# Altium schematic sheet mc_ma.SchDoc
size A4
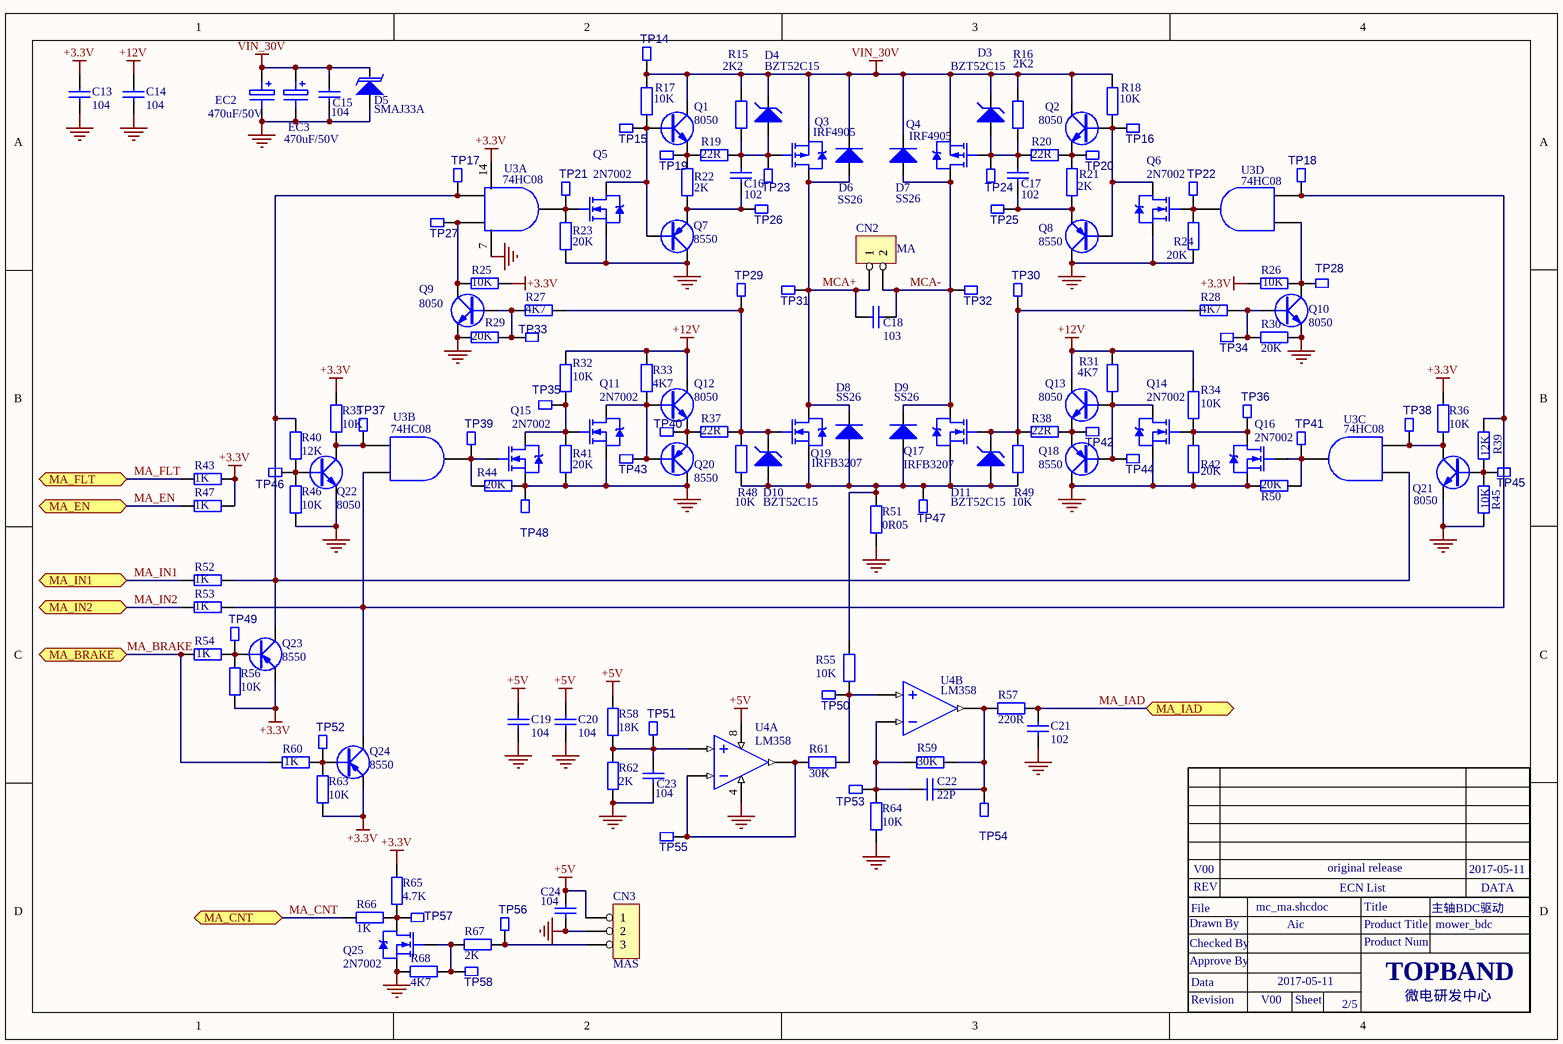
[diagram p0: mc_ma.SchDoc]

## Parts
C13  104  [0603C]
C14  104  [0603C]
C15  104  [0805C]
C16  102  [0805C]
C17  102  [0805C]
C18  103  [1206C]
C19  104  [0603C]
C20  104  [0603C]
C21  102  [0603C]
C22  22P  [0603C]
C23  104  [0603C]
C24  104  [0603C]
CN2  MA  [CON2-3.96]
CN3  MAS  [CON3-2.54]
D3  BZT52C15  [SOD-123]
D4  BZT52C15  [SOD-123]
D5  SMAJ33A  [DO-214AC]
D6  SS26  [SMB]
D7  SS26  [SMB]
D8  SS26  [SMB]
D9  SS26  [SMB]
D10  BZT52C15  [SOD-123]
D11  BZT52C15  [SOD-123]
EC2  470uF/50V  [EC12.5]
EC3  470uF/50V  [EC12.5]
Q1  8050  [SOT-23-BCE]
Q2  8050  [SOT-23-BCE]
Q3  IRF4905  [TO-220-GDS]
Q4  IRF4905  [TO-220-GDS]
Q5  2N7002  [SOT-23-GDS]
Q6  2N7002  [SOT-23-GDS]
Q7  8550  [SOT-23-BCE]
Q8  8550  [SOT-23-BCE]
Q9  8050  [SOT-23-BCE]
Q10  8050  [SOT-23-BCE]
Q11  2N7002  [SOT-23-GDS]
Q12  8050  [SOT-23-BCE]
Q13  8050  [SOT-23-BCE]
Q14  2N7002  [SOT-23-GDS]
Q15  2N7002  [SOT-23-GDS]
Q16  2N7002  [SOT-23-GDS]
Q17  IRFB3207  [TO-220-GDS]
Q18  8550  [SOT-23-BCE]
Q19  IRFB3207  [TO-220-GDS]
Q20  8550  [SOT-23-BCE]
Q21  8050  [SOT-23-BCE]
Q22  8050  [SOT-23-BCE]
Q23  8550  [SOT-23-BCE]
Q24  8550  [SOT-23-BCE]
Q25  2N7002  [SOT-23-GDS]
R15  2K2  [0805R]
R16  2K2  [0805R]
R17  10K  [0603R]
R18  10K  [0603R]
R19  22R  [0805R]
R20  22R  [0805R]
R21  2K  [0805R]
R22  2K  [0805R]
R23  20K  [0603R]
R24  20K  [0603R]
R25  10K  [0603R]
R26  10K  [0603R]
R27  4K7  [0603R]
R28  4K7  [0603R]
R29  20K  [0603R]
R30  20K  [0603R]
R31  4K7  [0603R]
R32  10K  [0603R]
R33  4K7  [0603R]
R34  10K  [0603R]
R35  10K  [0603R]
R36  10K  [0603R]
R37  22R  [0805R]
R38  22R  [0805R]
R39  12K  [0603R]
R40  12K  [0603R]
R41  20K  [0603R]
R42  20K  [0603R]
R43  1K  [0603R]
R44  20K  [0603R]
R45  10K  [0603R]
R46  10K  [0603R]
R47  1K  [0603R]
R48  10K  [0603R]
R49  10K  [0603R]
R50  20K  [0603R]
R51  0R05  [2512R]
R52  1K  [0603R]
R53  1K  [0603R]
R54  1K  [0603R]
R55  10K  [0603R]
R56  10K  [0603R]
R57  220R  [0603R]
R58  18K  [0603R]
R59  30K  [0603R]
R60  1K  [0603R]
R61  30K  [0603R]
R62  2K  [0603R]
R63  10K  [0603R]
R64  10K  [0603R]
R65  4.7K  [0603R]
R66  1K  [0603R]
R67  2K  [0603R]
R68  4K7  [0603R]
TP14  TP  [TEST-0.8MM]  (value not drawn)
TP15  TP  [TEST-0.8MM]  (value not drawn)
TP16  TP  [TEST-0.8MM]  (value not drawn)
TP17  TP  [TEST-0.8MM]  (value not drawn)
TP18  TP  [TEST-0.8MM]  (value not drawn)
TP19  TP  [TEST-0.8MM]  (value not drawn)
TP20  TP  [TEST-0.8MM]  (value not drawn)
TP21  TP  [TEST-0.8MM]  (value not drawn)
TP22  TP  [TEST-0.8MM]  (value not drawn)
TP23  TP  [TEST-0.8MM]  (value not drawn)
TP24  TP  [TEST-0.8MM]  (value not drawn)
TP25  TP  [TEST-0.8MM]  (value not drawn)
TP26  TP  [TEST-0.8MM]  (value not drawn)
TP27  TP  [TEST-0.8MM]  (value not drawn)
TP28  TP  [TEST-0.8MM]  (value not drawn)
TP29  TP  [TEST-0.8MM]  (value not drawn)
TP30  TP  [TEST-0.8MM]  (value not drawn)
TP31  TP  [TEST-0.8MM]  (value not drawn)
TP32  TP  [TEST-0.8MM]  (value not drawn)
TP33  TP  [TEST-0.8MM]  (value not drawn)
TP34  TP  [TEST-0.8MM]  (value not drawn)
TP35  TP  [TEST-0.8MM]  (value not drawn)
TP36  TP  [TEST-0.8MM]  (value not drawn)
TP37  TP  [TEST-0.8MM]  (value not drawn)
TP38  TP  [TEST-0.8MM]  (value not drawn)
TP39  TP  [TEST-0.8MM]  (value not drawn)
TP40  TP  [TEST-0.8MM]  (value not drawn)
TP41  TP  [TEST-0.8MM]  (value not drawn)
TP42  TP  [TEST-0.8MM]  (value not drawn)
TP43  TP  [TEST-0.8MM]  (value not drawn)
TP44  TP  [TEST-0.8MM]  (value not drawn)
TP45  TP  [TEST-0.8MM]  (value not drawn)
TP46  TP  [TEST-0.8MM]  (value not drawn)
TP47  TP  [TEST-0.8MM]  (value not drawn)
TP48  TP  [TEST-0.8MM]  (value not drawn)
TP49  TP  [TEST-0.8MM]  (value not drawn)
TP50  TP  [TEST-0.8MM]  (value not drawn)
TP51  TP  [TEST-0.8MM]  (value not drawn)
TP52  TP  [TEST-0.8MM]  (value not drawn)
TP53  TP  [TEST-0.8MM]  (value not drawn)
TP54  TP  [TEST-0.8MM]  (value not drawn)
TP55  TP  [TEST-0.8MM]  (value not drawn)
TP56  TP  [TEST-0.8MM]  (value not drawn)
TP57  TP  [TEST-0.8MM]  (value not drawn)
TP58  TP  [TEST-0.8MM]  (value not drawn)
U3  74HC08  [SO-14]  (parts A,B,C,D of 4)
U4  LM358  [SO-8]  (parts A,B of 2)

## Ports
MA_BRAKE, MA_CNT, MA_EN, MA_FLT, MA_IAD, MA_IN1, MA_IN2

## Nets
+3.3V: C13.2 Q23.E Q24.E R25.2 R26.1 R35.1 R36.2 R43.2 R47.2 R56.2 R63.2 R65.2 U3.14(VCC)
+5V: C19.2 C20.2 C24.2 CN3.1 R58.2 U4.8(VCC)
+12V: C14.2 Q12.C Q13.C R31.1 R32.2 R33.2 R34.2
GND: C13.1 C14.1 C15.1 C19.1 C20.1 C21.2 C23.1 C24.1 CN3.2 D5.A EC2.2 EC3.2 Q5.S Q6.S Q7.C Q8.C Q9.E Q10.E Q11.S Q14.S Q15.S Q16.S Q18.C Q20.C Q21.E Q22.E Q25.S R23.2 R24.1 R29.1 R30.2 R41.2 R42.2 R44.2 R45.1 R46.1 R50.1 R51.1 R62.1 R64.1 R68.1 TP48.1 U3.7(GND) U4.4(GND)
VIN_30V: C15.2 D3.K D4.K D5.K D6.K D7.K EC2.1 EC3.1 Q1.C Q2.C Q3.S Q4.S R15.1 R16.1 R17.1 R18.1 TP14.1
MA_BRAKE: R54.2 R60.2 ; port MA_BRAKE
MA_CNT: R66.1 ; port MA_CNT
MA_EN: R47.1 ; port MA_EN
MA_FLT: R43.1 ; port MA_FLT
MA_IAD: C21.1 R57.2 ; port MA_IAD
MA_IN1: R52.1 ; port MA_IN1
MA_IN2: R53.1 ; port MA_IN2
MCA+: C18.1 CN2.1 D6.A D8.K Q3.D Q19.D TP31.1
MCA-: C18.2 CN2.2 D7.A D9.K Q4.D Q17.D TP32.1
NetC16_1: C16.1 D4.A Q3.G R15.2 R19.2 TP23.1
NetC16_2: C16.2 Q7.E R22.2 TP26.1
NetC17_1: C17.1 D3.A Q4.G R16.2 R20.1 TP24.1
NetC17_2: C17.2 Q8.E R21.2 TP25.1
NetC22_1: C22.1 R57.1 R59.1 TP54.1 U4.1(OUT2)
NetC22_2: C22.2 R59.2 R64.2 TP53.1 U4.2(-IN2)
NetC23_2: C23.2 R58.1 R62.2 TP51.1 U4.5(+IN1)
NetCN3_3: CN3.3 R67.1 TP56.1
NetD8_A: D8.A D9.A D10.A D11.A Q17.S Q19.S R48.1 R49.1 R51.2 R55.1 TP47.1
NetD10_K: D10.K Q19.G R27.2 R37.2 R48.2 TP29.1
NetD11_K: D11.K Q17.G R28.1 R38.1 R49.2 TP30.1
NetQ1_B: Q1.B Q5.D Q7.B R17.2 TP15.1
NetQ1_E: Q1.E R19.1 R22.1 TP19.1
NetQ2_B: Q2.B Q6.D Q8.B R18.2 TP16.1
NetQ2_E: Q2.E R20.2 R21.1 TP20.1
NetQ5_G: Q5.G R23.1 TP21.1 U3.3(1Y)
NetQ6_G: Q6.G R24.2 TP22.1 U3.11(4Y)
NetQ9_B: Q9.B R27.1 R29.2 TP33.1
NetQ9_C: Q9.C R25.1 TP27.1 U3.2(1B)
NetQ10_B: Q10.B R28.2 R30.1 TP34.1
NetQ10_C: Q10.C R26.2 TP28.1 U3.12(4A)
NetQ11_D: Q11.D Q12.B Q20.B R33.1 TP43.1
NetQ11_G: Q11.G Q15.D R32.1 R41.1 TP35.1
NetQ12_E: Q12.E Q20.E R37.1 TP40.1
NetQ13_B: Q13.B Q14.D Q18.B R31.2 TP44.1
NetQ13_E: Q13.E Q18.E R38.2 TP42.1
NetQ14_G: Q14.G Q16.D R34.1 R42.1 TP36.1
NetQ15_G: Q15.G R44.1 TP39.1 U3.6(2Y)
NetQ16_G: Q16.G R50.2 TP41.1 U3.8(3Y)
NetQ21_B: Q21.B R39.1 R45.2 TP45.1
NetQ21_C: Q21.C R36.1 TP38.1 U3.10(3B)
NetQ22_B: Q22.B R40.2 R46.2 TP46.1
NetQ22_C: Q22.C R35.2 TP37.1 U3.4(2A)
NetQ23_B: Q23.B R54.1 R56.1 TP49.1
NetQ23_C: Q23.C R40.1 R52.2 TP17.1 U3.1(1A) U3.9(3A)
NetQ24_B: Q24.B R60.1 R63.1 TP52.1
NetQ24_C: Q24.C R39.2 R53.2 TP18.1 U3.5(2B) U3.13(4B)
NetQ25_D: Q25.D R65.1 R66.2 TP57.1
NetQ25_G: Q25.G R67.2 R68.2 TP58.1
NetR55_2: R55.2 R61.2 TP50.1 U4.3(IN2+)
NetR61_1: R61.1 TP55.1 U4.6(-IN1) U4.7(OUT1)

## Notes on the sheet
- Drawn By
- File
- REV
- V00
- mc_ma.shcdoc
- Aic
- original release
- ECN List
- Product Title
- Title
- 主轴BDC驱动
- mower_bdc
- 2017-05-11
- DATA
- Approve By
- Checked By
- Data
- Product Num
- TOPBAND
- Revision
- Sheet
- 2/5
- 微电研发中心

## Library data of the parts
C13-C24 = Cap(0603): Component Kind: standard; Component Type: standard
CN2 = 2Pin(卧式): 插座; U_TABLE: U_SAM01021601; id: 20; Part Number: 2Pin(卧式); Component Kind: Standard; Component Type: Standard; Designator: 2Pin(卧式); Footprint: CON2-2.54卧式; Pin Count: 2
CN3 = 3Pin(卧式): 插座; U_TABLE: U_SAM01021601; id: 26; Part Number: 3Pin(卧式); Component Kind: standard; Component Type: standard; Designator: 3Pin(卧式); Footprint: CON3-2.54卧式; Pin Count: 3
D3 D4 D10 D11 = D Zener(贴片): 120301303; U_TABLE: U_SAM010203; id: 25; Description: 稳压二极管; Part Number: D Zener(贴片); Component Kind: standard; Component Type: standard; Pin Count: 2
D5 = Diode(TVS_贴片)_1: 120301346; U_TABLE: U_SAM010203; id: 28; Description: TVS管; Part Number: Diode(TVS_贴片)_1; Component Kind: standard; Component Type: standard; Pin Count: 2
D6-D9 = Diode(DO-35)-D: 二极管; U_TABLE: U_SAM010203; id: 32; Part Number: Diode(DO-35)-D; Component Kind: standard; Component Type: standard; Pin Count: 2
EC2 EC3 = Electro(2.5mm): 150200079; U_TABLE: U_SAM010202; id: 42; Description: 电解电容; Part Number: Electro(2.5mm); Component Kind: standard; Component Type: standard; Pin Count: 2
Q1 Q2 Q9 Q10 Q12 Q13 Q21 Q22 = NPN(贴片): 三极管; U_TABLE: U_SAM010204; id: 18; Part Number: NPN(贴片); Component Kind: standard; Component Type: standard; Pin Count: 3
Q3 Q4 = PMOS-2: MOS管; U_TABLE: U_SAM010204; id: 19; Part Number: PMOS-2; Component Kind: standard; Component Type: standard; Pin Count: 3
Q5 Q6 Q11 Q14-Q17 Q19 Q25 = NMOS-2: MOS管; U_TABLE: U_SAM010204; id: 17; Part Number: NMOS-2; Component Kind: standard; Component Type: standard; Pin Count: 3
Q7 Q8 Q18 Q20 Q23 Q24 = PNP(贴片): 三极管; U_TABLE: U_SAM010204; id: 20; Part Number: PNP(贴片); Component Kind: standard; Component Type: standard; Pin Count: 3
R15-R42 R44-R46 R48-R51 R65 = Res2: Resistor; Value: 1K; 物料编码: 150103083; Published: 8-Jun-2000; LatestRevisionDate: 17-Jul-2002; LatestRevisionNote: Re-released for DXP Platform.; PackageReference: AXIAL-0.4; Publisher: Altium Limited
R43 R47 R52-R54 R60 = Res2: Resistor; 物料编码: 150103083; Published: 8-Jun-2000; LatestRevisionDate: 17-Jul-2002; LatestRevisionNote: Re-released for DXP Platform.; PackageReference: AXIAL-0.4; Publisher: Altium Limited; Value: 1K
R55 R57 R59 R61 R64 = Res2: Resistor; Value: 1K; Published: 8-Jun-2000; LatestRevisionDate: 17-Jul-2002; LatestRevisionNote: Re-released for DXP Platform.; PackageReference: AXIAL-0.4; Publisher: Altium Limited
R56 R58 R62 R63 R66-R68 = Res2: Resistor; Published: 8-Jun-2000; LatestRevisionDate: 17-Jul-2002; LatestRevisionNote: Re-released for DXP Platform.; PackageReference: AXIAL-0.4; Publisher: Altium Limited
U4 = IC_LM358: 121000225; U_TABLE: U_SAM010210; Description: 集成电路; id: 83; U_ITEM_ID（物料编码）: 121000100; U_100114（SAP物料描述）: SMT运放LM358_SO-8_TI_环保; U_100047（环保属性）: 环保; U_100107（工厂BOM使用频率）: 1000:1;1500:12;3000:7;5000:14;; U_100105（工厂库存）: 1000:7508.000;1500:160.000;2000:0.000;3000:485.000;5000:1542.000;; U_100117（工厂采购量）: 1000:7500.000;1500:300.000;3000:2500.000;5000:7500.000;; Part Number: IC_LM358; Component Kind: standard; Component Type: standard; Designator: IC_LM358; Footprint: DIP14; Pin Count: 8; U_100076（型号）: LM358; U_100040（封装方式）: SO-8; U_100086（指定供应商）: TI